# Altium schematic sheet Drivers - Low Current.SchDoc: Low Current Drivers
size Letter; Date: 2017-02-17; Revision: A; SheetNumber: 4; SheetTotal: 11; ProjectTitle: PDUv17: Power Distribution Unit
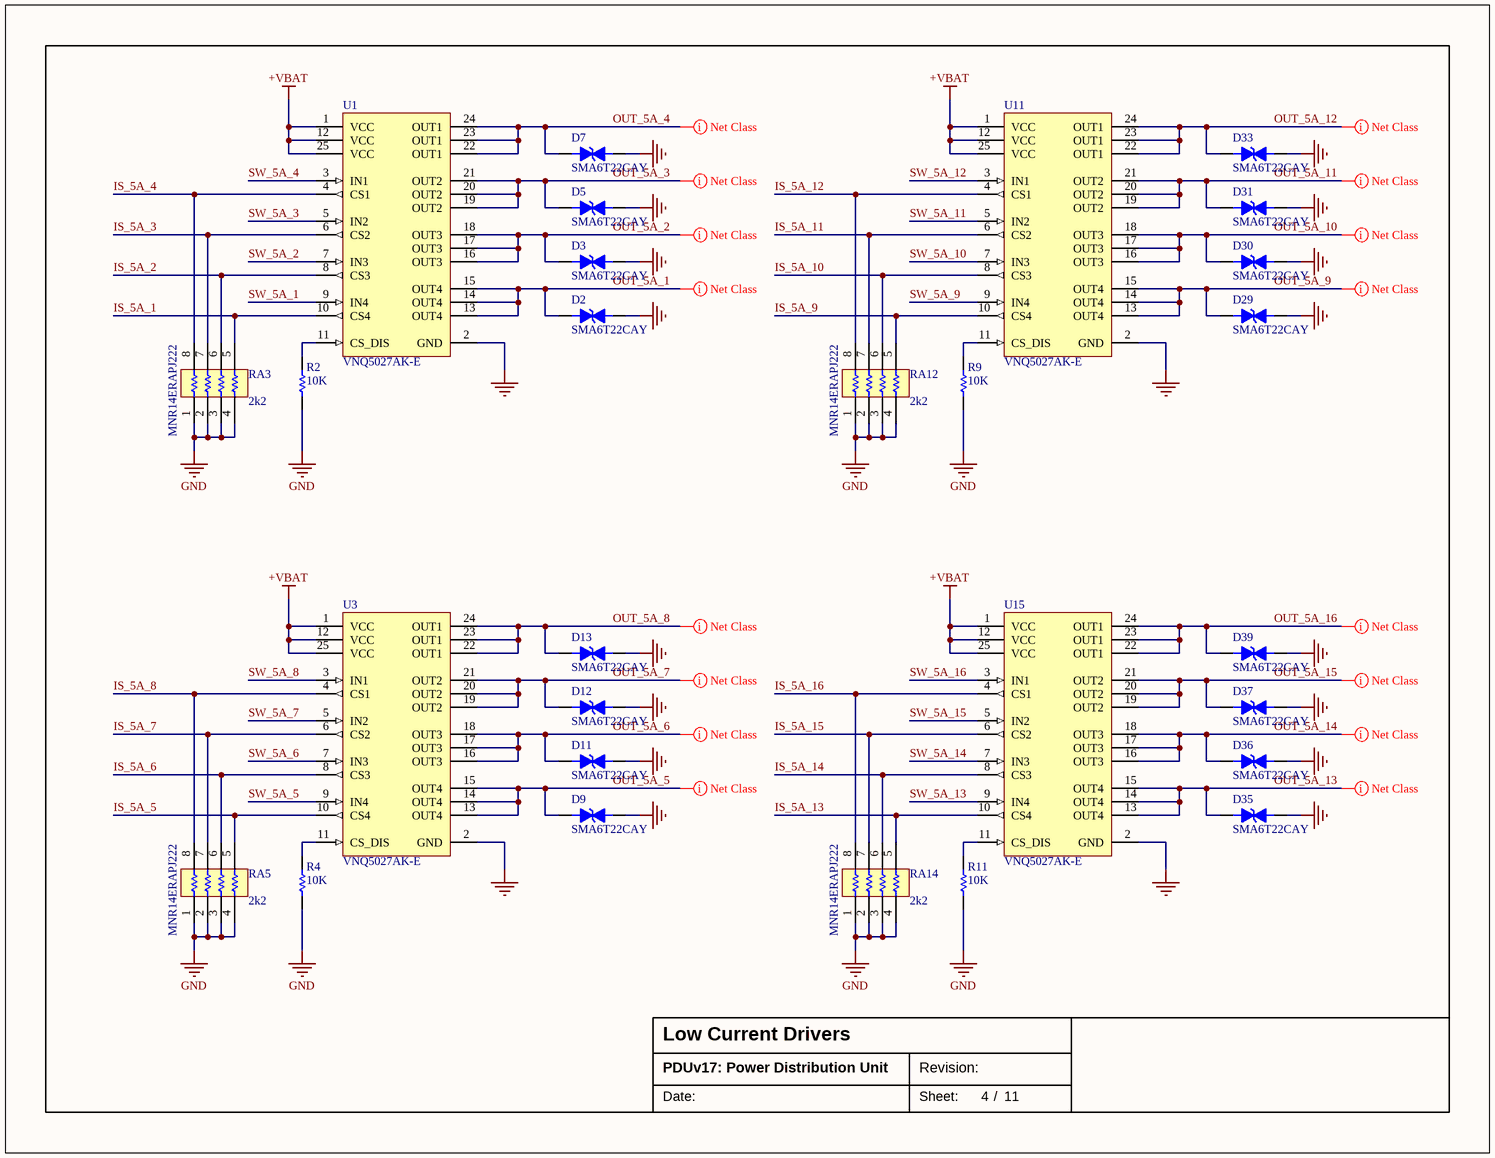
[diagram p0: Drivers - Low Current.SchDoc]

## Parts
D2  SMA6T22CAY  [DIOM4326X25N]
D3  SMA6T22CAY  [DIOM4326X25N]
D5  SMA6T22CAY  [DIOM4326X25N]
D7  SMA6T22CAY  [DIOM4326X25N]
D9  SMA6T22CAY  [DIOM4326X25N]
D11  SMA6T22CAY  [DIOM4326X25N]
D12  SMA6T22CAY  [DIOM4326X25N]
D13  SMA6T22CAY  [DIOM4326X25N]
D29  SMA6T22CAY  [DIOM4326X25N]
D30  SMA6T22CAY  [DIOM4326X25N]
D31  SMA6T22CAY  [DIOM4326X25N]
D33  SMA6T22CAY  [DIOM4326X25N]
D35  SMA6T22CAY  [DIOM4326X25N]
D36  SMA6T22CAY  [DIOM4326X25N]
D37  SMA6T22CAY  [DIOM4326X25N]
D39  SMA6T22CAY  [DIOM4326X25N]
R2  value 10K  [RES-0603-M]  (hidden comment: RES 10K 1% 1/10 W 0603 ±100ppm/°C)
R4  value 10K  [RES-0603-M]  (hidden comment: RES 10K 1% 1/10 W 0603 ±100ppm/°C)
R9  value 10K  [RES-0603-M]  (hidden comment: RES 10K 1% 1/10 W 0603 ±100ppm/°C)
R11  value 10K  [RES-0603-M]  (hidden comment: RES 10K 1% 1/10 W 0603 ±100ppm/°C)
RA3  MNR14ERAPJ222  value 2k2  [CAC-80P319X150-8N]
RA5  MNR14ERAPJ222  value 2k2  [CAC-80P319X150-8N]
RA12  MNR14ERAPJ222  value 2k2  [CAC-80P319X150-8N]
RA14  MNR14ERAPJ222  value 2k2  [CAC-80P319X150-8N]
U1  VNQ5027AK-E  [SOP80P1030X245_HS-25N]
U3  VNQ5027AK-E  [SOP80P1030X245_HS-25N]
U11  VNQ5027AK-E  [SOP80P1030X245_HS-25N]
U15  VNQ5027AK-E  [SOP80P1030X245_HS-25N]

## Nets
+VBAT: U1.1(VCC) U1.12(VCC) U1.25(VCC) U3.1(VCC) U3.12(VCC) U3.25(VCC) U11.1(VCC) U11.12(VCC) U11.25(VCC) U15.1(VCC) U15.12(VCC) U15.25(VCC)
GND: D2.1(K) D3.1(K) D5.1(K) D7.1(K) D9.1(K) D11.1(K) D12.1(K) D13.1(K) D29.1(K) D30.1(K) D31.1(K) D33.1(K) D35.1(K) D36.1(K) D37.1(K) D39.1(K) R2.1 R4.1 R9.1 R11.1 RA3.1 RA3.2 RA3.3 RA3.4 RA5.1 RA5.2 RA5.3 RA5.4 RA12.1 RA12.2 RA12.3 RA12.4 RA14.1 RA14.2 RA14.3 RA14.4 U1.2(GND) U3.2(GND) U11.2(GND) U15.2(GND)
IS_5A_1: RA3.5 U1.10(CS4)
IS_5A_2: RA3.6 U1.8(CS3)
IS_5A_3: RA3.7 U1.6(CS2)
IS_5A_4: RA3.8 U1.4(CS1)
IS_5A_5: RA5.5 U3.10(CS4)
IS_5A_6: RA5.6 U3.8(CS3)
IS_5A_7: RA5.7 U3.6(CS2)
IS_5A_8: RA5.8 U3.4(CS1)
IS_5A_9: RA12.5 U11.10(CS4)
IS_5A_10: RA12.6 U11.8(CS3)
IS_5A_11: RA12.7 U11.6(CS2)
IS_5A_12: RA12.8 U11.4(CS1)
IS_5A_13: RA14.5 U15.10(CS4)
IS_5A_14: RA14.6 U15.8(CS3)
IS_5A_15: RA14.7 U15.6(CS2)
IS_5A_16: RA14.8 U15.4(CS1)
OUT_5A_1: D2.2(A) U1.13(OUT4) U1.14(OUT4) U1.15(OUT4)
OUT_5A_2: D3.2(A) U1.16(OUT3) U1.17(OUT3) U1.18(OUT3)
OUT_5A_3: D5.2(A) U1.19(OUT2) U1.20(OUT2) U1.21(OUT2)
OUT_5A_4: D7.2(A) U1.22(OUT1) U1.23(OUT1) U1.24(OUT1)
OUT_5A_5: D9.2(A) U3.13(OUT4) U3.14(OUT4) U3.15(OUT4)
OUT_5A_6: D11.2(A) U3.16(OUT3) U3.17(OUT3) U3.18(OUT3)
OUT_5A_7: D12.2(A) U3.19(OUT2) U3.20(OUT2) U3.21(OUT2)
OUT_5A_8: D13.2(A) U3.22(OUT1) U3.23(OUT1) U3.24(OUT1)
OUT_5A_9: D29.2(A) U11.13(OUT4) U11.14(OUT4) U11.15(OUT4)
OUT_5A_10: D30.2(A) U11.16(OUT3) U11.17(OUT3) U11.18(OUT3)
OUT_5A_11: D31.2(A) U11.19(OUT2) U11.20(OUT2) U11.21(OUT2)
OUT_5A_12: D33.2(A) U11.22(OUT1) U11.23(OUT1) U11.24(OUT1)
OUT_5A_13: D35.2(A) U15.13(OUT4) U15.14(OUT4) U15.15(OUT4)
OUT_5A_14: D36.2(A) U15.16(OUT3) U15.17(OUT3) U15.18(OUT3)
OUT_5A_15: D37.2(A) U15.19(OUT2) U15.20(OUT2) U15.21(OUT2)
OUT_5A_16: D39.2(A) U15.22(OUT1) U15.23(OUT1) U15.24(OUT1)
SW_5A_1: U1.9(IN4)
SW_5A_2: U1.7(IN3)
SW_5A_3: U1.5(IN2)
SW_5A_4: U1.3(IN1)
SW_5A_5: U3.9(IN4)
SW_5A_6: U3.7(IN3)
SW_5A_7: U3.5(IN2)
SW_5A_8: U3.3(IN1)
SW_5A_9: U11.9(IN4)
SW_5A_10: U11.7(IN3)
SW_5A_11: U11.5(IN2)
SW_5A_12: U11.3(IN1)
SW_5A_13: U15.9(IN4)
SW_5A_14: U15.7(IN3)
SW_5A_15: U15.5(IN2)
SW_5A_16: U15.3(IN1)
NetR2_2: R2.2 U1.11(CS_DIS)
NetR4_2: R4.2 U3.11(CS_DIS)
NetR9_2: R9.2 U11.11(CS_DIS)
NetR11_2: R11.2 U15.11(CS_DIS)

## Layout directives
net class OUT_5A: OUT_5A_1, OUT_5A_2, OUT_5A_3, OUT_5A_4, OUT_5A_5, OUT_5A_6, OUT_5A_7, OUT_5A_8, OUT_5A_9, OUT_5A_10, OUT_5A_11, OUT_5A_12, OUT_5A_13, OUT_5A_14, OUT_5A_15, OUT_5A_16

## Notes on the sheet
- Date:
- Revision:
- Sheet:
- /

## Library data of the parts
R2 R4 R9 R11 = RC0603FR-0710KL: Manufacturer: Yageo; Manufacturer Series: RC; Power: 1/10 W; Part Number: RC0603FR-0710KL; Component Type: Standard; Tolerance: 1%; Package: 0603; Temperature Coefficient: ±100ppm/°C; Temperature Range: -55°C ~ 155°C; Supplier 1: Digi-Key; Supplier Part Number 1: 311-10.0KHRCT-ND
U1 U3 U11 U15 = VNQ5027AK-E: Supplier 1: Digi-Key; Supplier Part Number 1: 497-11715-1-ND